# EAGLE design avrtarget (EAGLE 6.5.0)
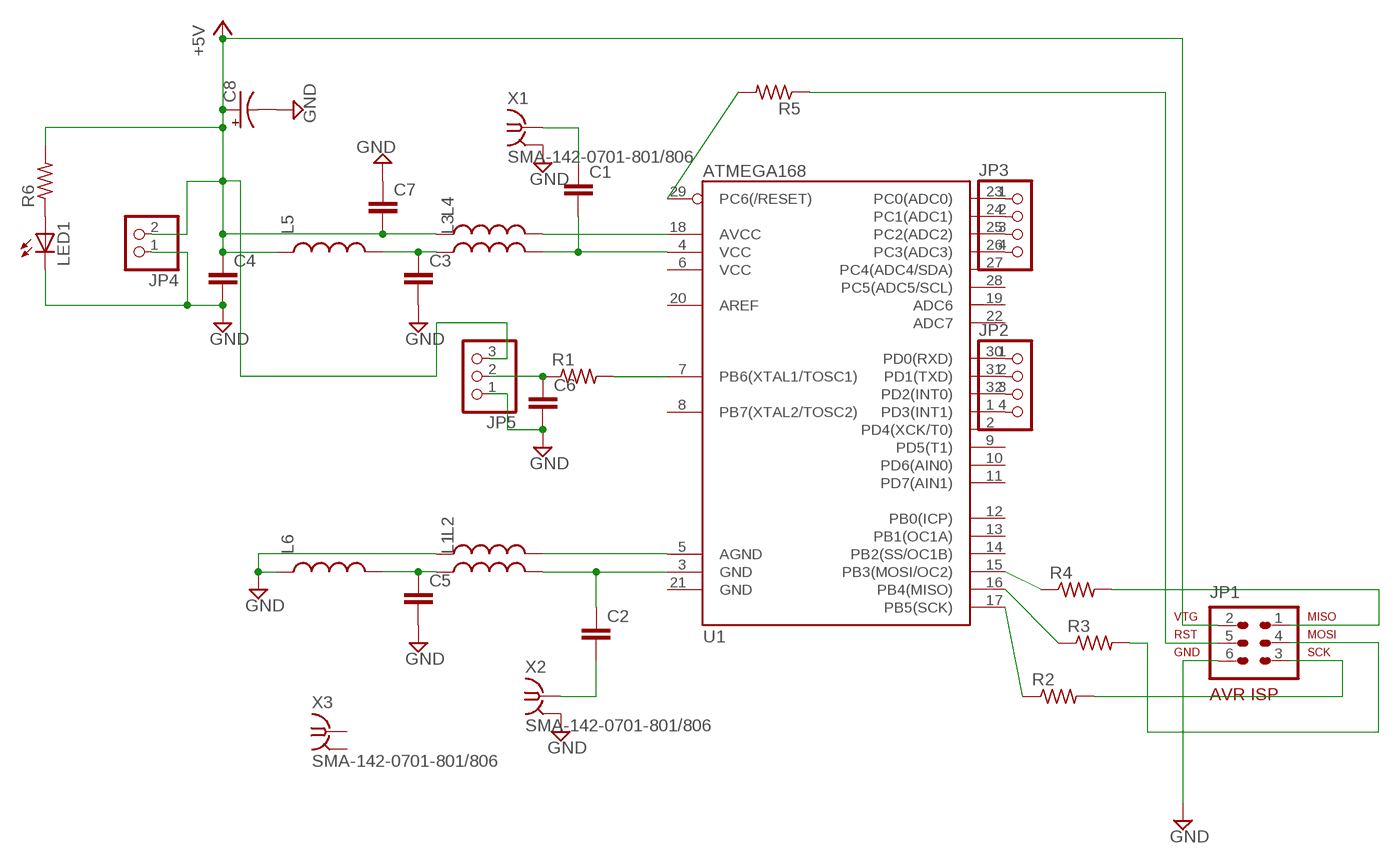
[diagram p0: schematic, sheet 1]

## Parts
C1  C-EUC0603  [C0603]
C2  C-EUC0603  [C0603]
C3  C-EUC0603  [C0603]
C4  C-EUC0603  [C0603]
C5  C-EUC0603  [C0603]
C6  C-EUC0603  [C0603]
C7  C-EUC0603  [C0603]
C8  CPOL-USE3.5-8  [E3,5-8]
JP1  AVR-ISP-6  [AVR-ISP-6]
JP2  PINHD-1X4  [1X04]
JP3  PINHD-1X4  [1X04]
JP4  PINHD-1X2  [1X02]
JP5  PINHD-1X3  [1X03]
L1  INDUCTOR0603  [0603]
L2  INDUCTOR0603  [0603]
L3  INDUCTOR0603  [0603]
L4  INDUCTOR0603  [0603]
L5  INDUCTOR0603  [0603]
L6  INDUCTOR0603  [0603]
LED1  LED-5MM  [LED-5MM]
R1  R-US_R0603  [R0603]
R2  R-US_R0603  [R0603]
R3  R-US_R0603  [R0603]
R4  R-US_R0603  [R0603]
R5  R-US_R0603  [R0603]
R6  R-US_R0603  [R0603]
U1  ATMEGA168  [TQFP32-08]
X1  SMA-142-0701-801/806  [J502-ND-142-0701-801/806]
X2  SMA-142-0701-801/806  [J502-ND-142-0701-801/806]
X3  SMA-142-0701-801/806  [J502-ND-142-0701-801/806]

## Nets
+5V: C4.1 C7.2 C8.+ JP1.2 JP4.2 JP5.3 L4.1 L5.1 R6.2
GND: C3.2 C4.2 C5.2 C6.2 C7.1 C8.- JP1.6 JP4.1 JP5.1 L2.1 L6.1 LED1.K(C) X1.G@1 X1.G@2 X1.G@3 X1.G@4 X2.G@1 X2.G@2 X2.G@3 X2.G@4
N$1: C1.2 L3.2 U1.4(VCC)
N$2: C2.1 L1.2 U1.3(GND)
N$3: C3.1 L3.1 L5.2
N$4: C5.1 L1.1 L6.2
N$5: R1.2 U1.7(PB6(XTAL1/TOSC1))
N$6: R2.1 U1.17(PB5(SCK))
N$7: R3.1 U1.16(PB4(MISO))
N$8: R4.1 U1.15(PB3(MOSI/OC2))
N$9: R5.2 U1.29(PC6(/RESET))
N$10: JP1.3 R2.2
N$11: JP1.4 R3.2
N$12: JP1.1 R4.2
N$13: C6.1 JP5.2 R1.1
N$14: C1.1 X1.1
N$15: L4.2 U1.18(AVCC)
N$16: C2.2 X2.1
N$17: JP1.5 R5.1
N$18: JP2.1 U1.30(PD0(RXD))
N$19: JP2.2 U1.31(PD1(TXD))
N$20: JP2.3 U1.32(PD2(INT0))
N$21: JP2.4 U1.1(PD3(INT1))
N$22: JP3.1 U1.23(PC0(ADC0))
N$23: JP3.2 U1.24(PC1(ADC1))
N$24: JP3.3 U1.25(PC2(ADC2))
N$25: JP3.4 U1.26(PC3(ADC3))
N$26: L2.2 U1.5(AGND)
N$30: LED1.A R6.1
Unconnected: U1.2(PD4(XCK/T0)) U1.6(VCC) U1.8(PB7(XTAL2/TOSC2)) U1.9(PD5(T1)) U1.10(PD6(AIN0)) U1.11(PD7(AIN1)) U1.12(PB0(ICP)) U1.13(PB1(OC1A)) U1.14(PB2(SS/OC1B)) U1.19(ADC6) U1.20(AREF) U1.21(GND) U1.22(ADC7) U1.27(PC4(ADC4/SDA)) U1.28(PC5(ADC5/SCL)) X3.1 X3.G@1 X3.G@2 X3.G@3 X3.G@4

## Library data of the parts
C1-C7 = resistor:C-EU: CAPACITOR, European symbol
C8 = rcl:CPOL-US: POLARIZED CAPACITOR, American symbol
JP1 = avr-6:AVR-ISP-6: AVR ISP-6 Serial Programming Header
JP2 JP3 = pinhead:PINHD-1X4: PIN HEADER
JP4 = pinhead:PINHD-1X2: PIN HEADER
JP5 = pinhead:PINHD-1X3: PIN HEADER
L1-L6 = SparkFun:INDUCTOR: Inductors Basic Inductor/Choke - 0603 and 1206. Footprints are not proven and vary greatly between part numbers.
LED1 = dp_devices:LED: Light Emitting Diode
R1-R6 = resistor:R-US_: RESISTOR, American symbol
U1 = SparkFun:ATMEGA168
X1-X3 = con-coax:SMA-: SMA 50 Ohm End Launch Jack Receptacle - Round Contact Johnson Components Source: www.johnsoncomponents.com .. J502-ND.pdf; MF: JOHNSON COMPONENTS; MPN: 142-0701-801; OC_FARNELL: 1608592; OC_NEWARK: 90F2624

## Board
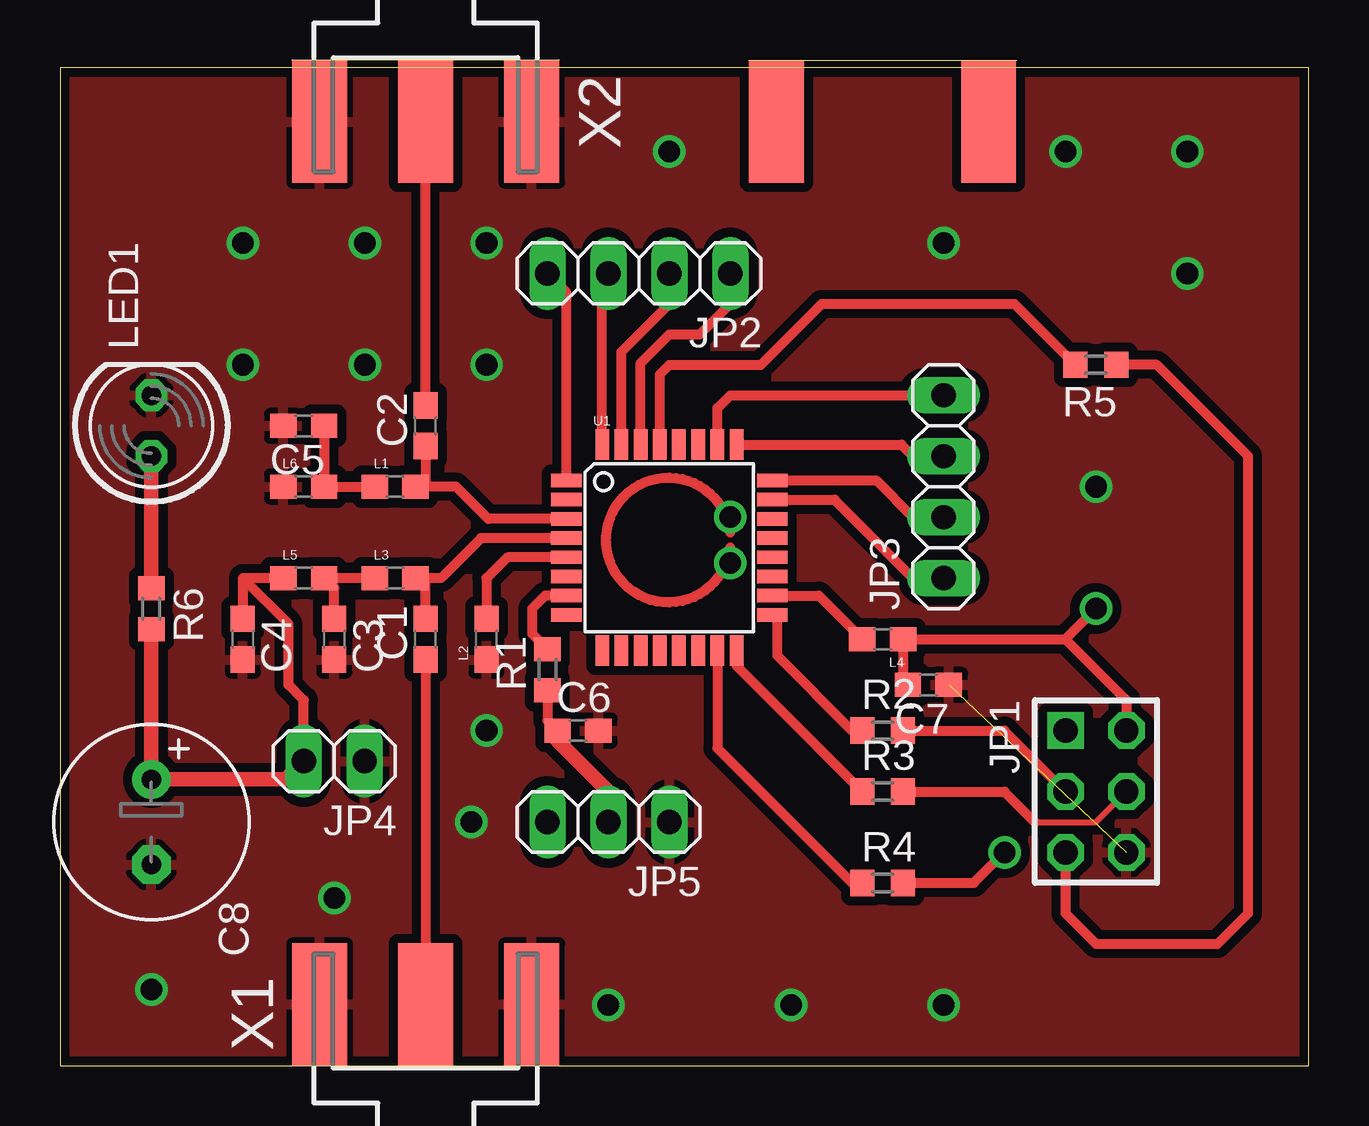
[diagram p1: board, top side]
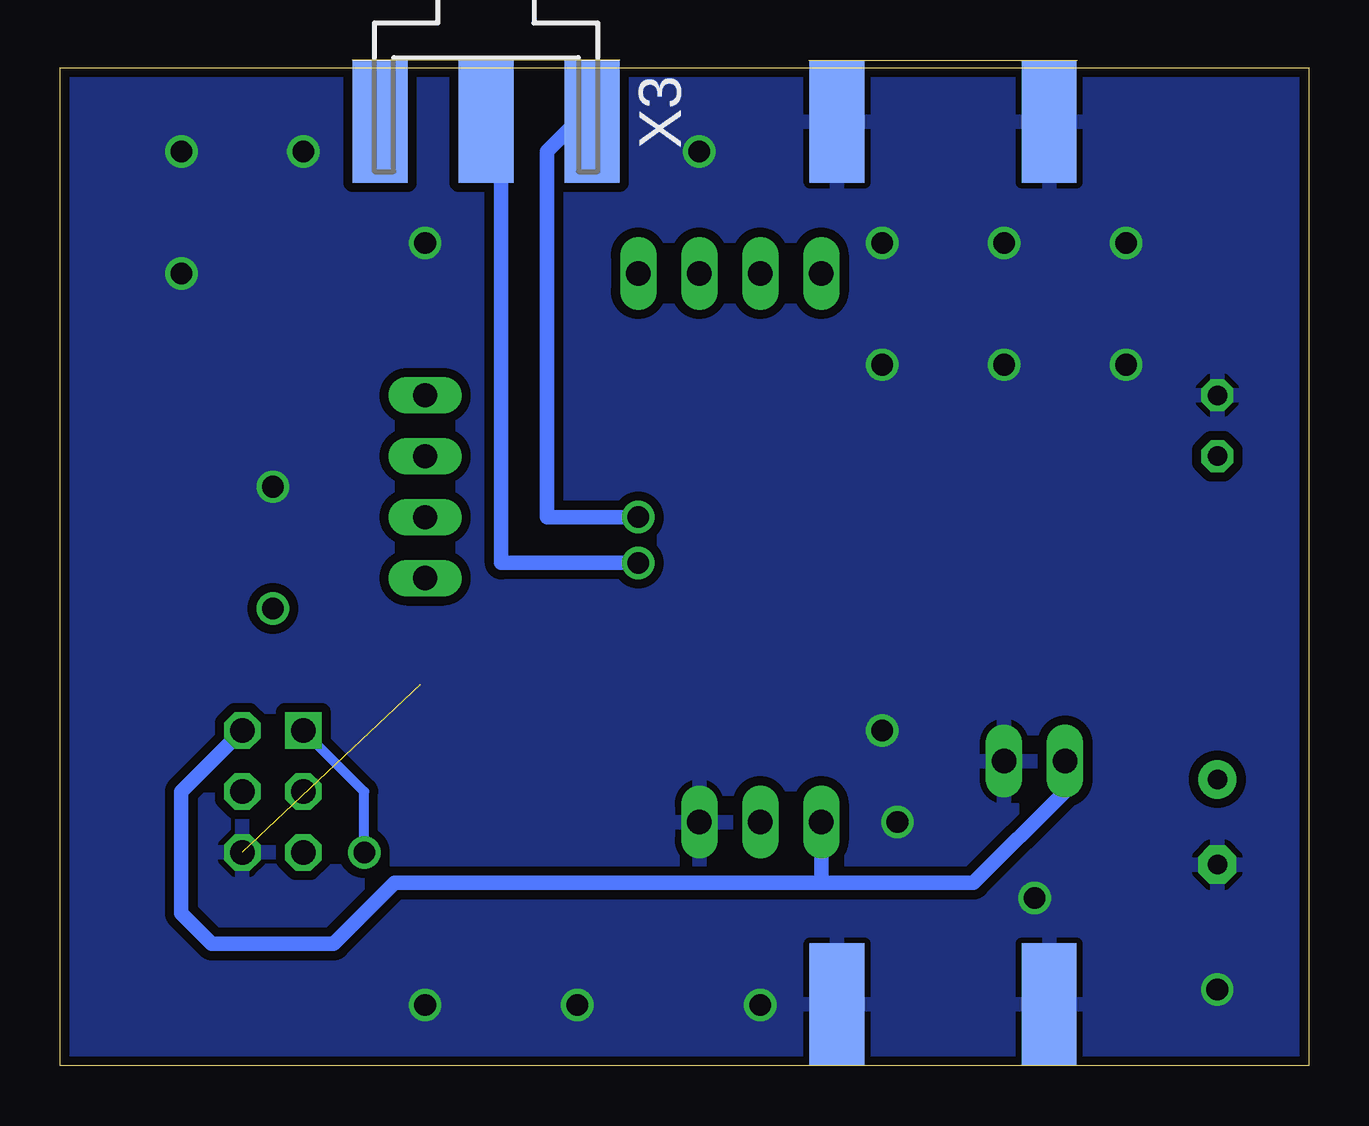
[diagram p2: board, bottom side, seen from below]

Size 52.05 x 41.58 mm. Coordinates in mm from the lower left corner, seen from the top.
Outline: 0,0 52.05,0 52.05,41.58 0,41.58 0,0
Copper layers (1*16): Top 0.035mm / dielectric 1.5mm / Bottom 0.035mm
Design rules "default *": minimum track width 10mil, minimum drill 24mil, track to track 8mil, track to pad 8mil, pad to pad 8mil, via to via 8mil, smd to smd 8mil, copper to edge 0.000253125mm, drill to drill 8mil, minimum pad ring 10mil, minimum via ring 8mil, stop-mask expansion 4mil, vias tented up to drill 0mil, thermal gap 10mil
tRestrict: 4 lines

### Footprints (pad centres in the part's own frame; a part is rotated, then mirrored left to right if it is on the bottom)
C0603 = smd 1.1 x 1: 1 -0.85,0; 2 0.85,0
E3,5-8 = drill 0.813 pad 1.6: + -1.778,0 | drill 0.813 pad 1.6 octagon: - 1.778,0
AVR-ISP-6 = drill 1.016 square: 1 -2.54,-1.27 | drill 1.016 octagon: 2 -2.54,1.27; 3 0,-1.27; 4 0,1.27; 5 2.54,-1.27; 6 2.54,1.27
1X04 = drill 1.016 long: 1 -3.81,0; 2 -1.27,0; 3 1.27,0; 4 3.81,0
1X02 = drill 1.016 long: 1 -1.27,0; 2 1.27,0
1X03 = drill 1.016 long: 1 -2.54,0; 2 0,0; 3 2.54,0
0603 = smd 1.1 x 1: 1 -0.85,0; 2 0.85,0
LED-5MM = drill 0.813 octagon: A -1.27,0; K 1.27,0
R0603 = smd 1 x 1.1: 1 -0.85,0; 2 0.85,0
TQFP32-08 = smd 1.27 x 0.559: 1 -4.293,2.8; 2 -4.293,2; 3 -4.293,1.2; 4 -4.293,0.4; 5 -4.293,-0.4; 6 -4.293,-1.2; 7 -4.293,-2; 8 -4.293,-2.8; 17 4.293,-2.8; 18 4.293,-2; 19 4.293,-1.2; 20 4.293,-0.4; 21 4.293,0.4; 22 4.293,1.2; 23 4.293,2; 24 4.293,2.8 | smd 0.559 x 1.27: 9 -2.8,-4.293; 10 -2,-4.293; 11 -1.2,-4.293; 12 -0.4,-4.293; 13 0.4,-4.293; 14 1.2,-4.293; 15 2,-4.293; 16 2.8,-4.293; 25 2.8,4.293; 26 2,4.293; 27 1.2,4.293; 28 0.4,4.293; 29 -0.4,4.293; 30 -1.2,4.293; 31 -2,4.293; 32 -2.8,4.293
J502-ND-142-0701-801/806 = smd 5.08 x 2.286: 1 2.565,0; G@1 2.565,4.42; G@2 2.565,-4.42 | smd 5.08 x 2.286 bottom: G@3 2.565,4.42; G@4 2.565,-4.42

### Placement (x,y rotation side)
C1  15.24,17.78 90 top
C2  15.24,26.67 90 top
C3  11.43,17.78 270 top
C4  7.62,17.78 270 top
C5  10.16,26.67 180 top
C6  21.59,13.97 0 top
C7  36.2,15.87 180 top
C8  3.81,10.16 270 top
JP1  43.18,11.43 270 top
JP2  24.13,33.02 180 top
JP3  36.83,24.13 90 top
JP4  11.43,12.7 180 top
JP5  22.86,10.16 180 top
L1  13.97,24.13 0 top
L2  17.78,17.78 90 top
L3  13.97,20.32 0 top
L4  34.29,17.78 180 top
L5  10.16,20.32 0 top
L6  10.16,24.13 0 top
LED1  3.81,26.67 90 top
R1  20.32,16.51 90 top
R2  34.29,13.97 0 top
R3  34.29,11.43 0 top
R4  34.29,7.62 0 top
R5  43.18,29.21 180 top
R6  3.81,19.05 270 top
U1  25.4,21.59 0 top
X1  15.24,0 90 top
X2  15.24,41.91 270 top
X3  34.29,41.91 270 bottom

### Tracks (layer width: path | path; a pad name or v marks a point on that pad's centre or on a via)
+5V  (via drill 0.9)
  Top 0.406: L5.1 7.62,20.32 | 7.62,20.32 C4.1 | 41.91,17.78 L4.1 35.14,16.08 C7.2 | 41.91,17.78 44.45,15.24 JP1.2 | JP4.2 10.16,15.24 9.53,15.87 9.53,18.42 7.62,20.32 | 41.91,17.78 v43.18,19.05
  Top 0.61: JP4.2 9.4,11.94 C8.+ R6.2
  Bottom 0.61: JP1.2 46.99,11.43 46.99,6.35 45.72,5.08 40.64,5.08 38.1,7.62 20.32,7.62 | 20.32,7.62 13.97,7.62 10.16,11.43 JP4.2 | JP5.3 20.32,7.62
GND  (via drill 0.9)  (1 unrouted)
  other vias: 36.83,2.54 43.18,24.13 46.99,38.1 46.99,33.02 25.4,38.1 17.78,34.29 17.78,29.21 12.7,29.21 12.7,34.29 7.62,34.29 7.62,29.21 17.78,13.97 36.83,34.29 41.91,38.1 30.48,2.54 22.86,2.54 17.14,10.16 11.43,6.98 3.81,3.18
  pour Top (isolate 0.381): 3.81,41.91 52.07,41.91 53.34,40.64 53.34,2.54 52.07,-2.54 3.81,-2.54 -2.54,2.54 -2.54,40.64
  pour Bottom (isolate 0.381): 0,41.91 52.07,41.91 52.07,0 0,0
N$1
  Top 0.406: U1.4 17.55,21.99 15.87,20.32 15.24,20.32 | C1.2 15.24,20.32 | 15.24,20.32 L3.2
N$2
  Top 0.406: U1.3 17.85,22.79 16.51,24.13 15.24,24.13 | C2.1 15.24,24.13 | 15.24,24.13 L1.2
N$3
  Top 0.406: L3.1 L5.2 11.43,19.9 C3.1
N$4
  Top 0.406: C5.1 L6.2 L1.1
N$5
  Top 0.406: U1.7 20.23,19.59 19.69,19.05 19.69,18 R1.2
N$6
  Top 0.406: U1.17 29.89,18.79 29.89,17.1 33.02,13.97 R2.1
N$7
  Top 0.406: U1.16 28.2,16.67 R3.1
N$8
  Top 0.406: U1.15 27.4,13.24 33.02,7.62 R4.1
N$9
  Top 0.406: U1.29 25,28.81 25.4,29.21 29.21,29.21 31.75,31.75 39.79,31.75 R5.2
N$10
  Top 0.406: R2.2 39.37,13.97 JP1.3
N$11
  Top 0.254: 40.64,10.16 43.18,10.16 JP1.4
  Top 0.406: R3.2 39.37,11.43 40.64,10.16
N$12  (via drill 0.9)
  Top 0.406: R4.2 38.1,7.62 v39.37,8.89
  Bottom 0.406: v39.37,8.89 39.37,11.43 JP1.1
N$13
  Top 0.406: R1.1 20.32,14.39 C6.1
  Top 0.61: C6.1 20.74,13.55 22.86,11.43 JP5.2
N$14
  Top 0.406: C1.1 X1.1
N$15
  Top 0.406: U1.18 31.63,19.59 L4.2
N$16
  Top 0.406: C2.2 X2.1
N$17
  Top 0.406: JP1.5 41.91,6.35 43.18,5.08 48.26,5.08 49.53,6.35 49.53,25.4 45.72,29.21 R5.1
N$18
  Top 0.406: U1.30 24.2,29.28 25.4,30.48 26.67,30.48 27.94,31.75 JP2.1
N$19
  Top 0.406: U1.31 23.4,29.75 25.4,31.75 JP2.2
N$20
  Top 0.406: U1.32 22.6,32.76 JP2.3
N$21
  Top 0.406: U1.1 21.11,32.23 JP2.4
N$22
  Top 0.406: U1.23 32.29,23.59 35.56,20.32 JP3.1
N$23
  Top 0.406: U1.24 34.03,24.39 35.56,22.86 JP3.2
N$24
  Top 0.406: U1.25 35.08,25.88 35.56,25.4 JP3.3
N$25
  Top 0.406: U1.26 27.4,27.4 27.94,27.94 JP3.4
N$26
  Top 0.406: U1.5 18.65,21.19 17.78,20.32 L2.2
N$27
  Top 0.406: 27.94,21.59 arc-346 27.94,22.23
N$28  (via drill 0.9)
  Bottom 0.61: v27.94,20.96 33.66,20.96 33.66,38.1 34.29,39.37
N$29  (via drill 0.9)
  Bottom 0.61: v27.94,22.86 31.75,22.86 31.75,38.1 30.48,39.37
N$30
  Top 0.61: LED1.A R6.1